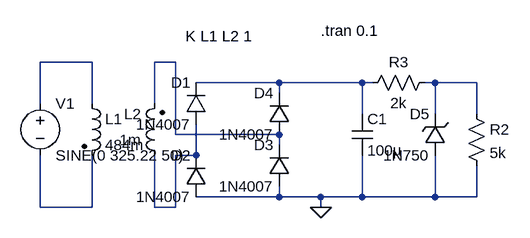
[diagram p0: schematic regulated_power_supply.asc]
regulated_power_supply.asc, the LTspice schematic file:
Version 4
SHEET 1 880 680
WIRE 96 48 16 48
WIRE 224 48 192 48
WIRE 384 80 256 80
WIRE 512 80 384 80
WIRE 528 80 512 80
WIRE 624 80 608 80
WIRE 688 80 624 80
WIRE 384 96 384 80
WIRE 16 112 16 48
WIRE 96 112 96 48
WIRE 192 112 192 48
WIRE 512 128 512 80
WIRE 624 128 624 80
WIRE 688 128 688 80
WIRE 224 160 224 48
WIRE 384 160 224 160
WIRE 384 176 384 160
WIRE 256 192 256 144
WIRE 256 192 224 192
WIRE 384 256 384 240
WIRE 384 256 256 256
WIRE 448 256 384 256
WIRE 512 256 512 192
WIRE 512 256 448 256
WIRE 624 256 624 192
WIRE 624 256 512 256
WIRE 688 256 688 208
WIRE 688 256 624 256
WIRE 16 272 16 192
WIRE 96 272 96 192
WIRE 96 272 16 272
WIRE 192 272 192 192
WIRE 224 272 224 192
WIRE 224 272 192 272
WIRE 448 272 448 256
FLAG 448 272 0
SYMBOL ind2 80 96 R0
SYMATTR InstName L1
SYMATTR Value 484m
SYMATTR Type ind
SYMATTR SpiceLine Rser=22
SYMBOL ind2 208 208 R180
WINDOW 0 36 80 Left 2
WINDOW 3 36 40 Left 2
SYMATTR InstName L2
SYMATTR Value 1m
SYMATTR Type ind
SYMATTR SpiceLine Rser=22
SYMBOL diode 400 240 R180
WINDOW 0 24 64 Left 2
WINDOW 3 24 0 Left 2
SYMATTR InstName D3
SYMATTR Value 1N4007
SYMBOL diode 400 160 R180
WINDOW 0 24 64 Left 2
WINDOW 3 24 0 Left 2
SYMATTR InstName D4
SYMATTR Value 1N4007
SYMBOL cap 496 128 R0
SYMATTR InstName C1
SYMATTR Value 100µ
SYMBOL res 672 112 R0
SYMATTR InstName R2
SYMATTR Value 5k
SYMBOL res 624 64 R90
WINDOW 0 0 56 VBottom 2
WINDOW 3 32 56 VTop 2
SYMATTR InstName R3
SYMATTR Value 2k
SYMBOL zener 640 192 R180
WINDOW 0 24 64 Left 2
WINDOW 3 24 0 Left 2
SYMATTR InstName D5
SYMATTR Value 1N750
SYMBOL diode 272 144 R180
WINDOW 0 24 64 Left 2
WINDOW 3 24 0 Left 2
SYMATTR InstName D1
SYMATTR Value 1N4007
SYMBOL diode 272 256 R180
WINDOW 0 24 64 Left 2
WINDOW 3 24 0 Left 2
SYMATTR InstName D2
SYMATTR Value 1N4007
SYMBOL voltage 16 96 R0
WINDOW 123 0 0 Left 0
WINDOW 39 0 0 Left 0
SYMATTR InstName V1
SYMATTR Value SINE(0 325.22 50)
TEXT 240 8 Left 2 !K L1 L2 1
TEXT 448 0 Left 2 !.tran 0.1

The netlist it stands for:
* regulated_power_supply.asc
L1 N001 N006 484m Rser=22
L2 N005 N002 1m Rser=22
D3 0 N002 1N4007
D4 N002 N003 1N4007
C1 N003 0 100µ
R2 N004 0 5k
R3 N004 N003 2k
D5 0 N004 1N750
D1 N005 N003 1N4007
D2 0 N005 1N4007
V1 N001 N006 SINE(0 325.22 50)
.model D D
.lib standard.dio
K L1 L2 1
.tran 0.1
.backanno
.end